# EasyEDA Pro project Pajero Gauges.epro, schematic Schematic2

## Sheets
1 ESP32 + Headers: Board Name: Updated_PCB; Create Date: 2026-03-27; Page Name: ESP32 + Headers; Project Name: Pajero Gauges Current V2; Schematic Name: Schematic2; Update Date: 2026-03-29; Company: EasyEDA.com; Page Size: A4; Version: V1.0
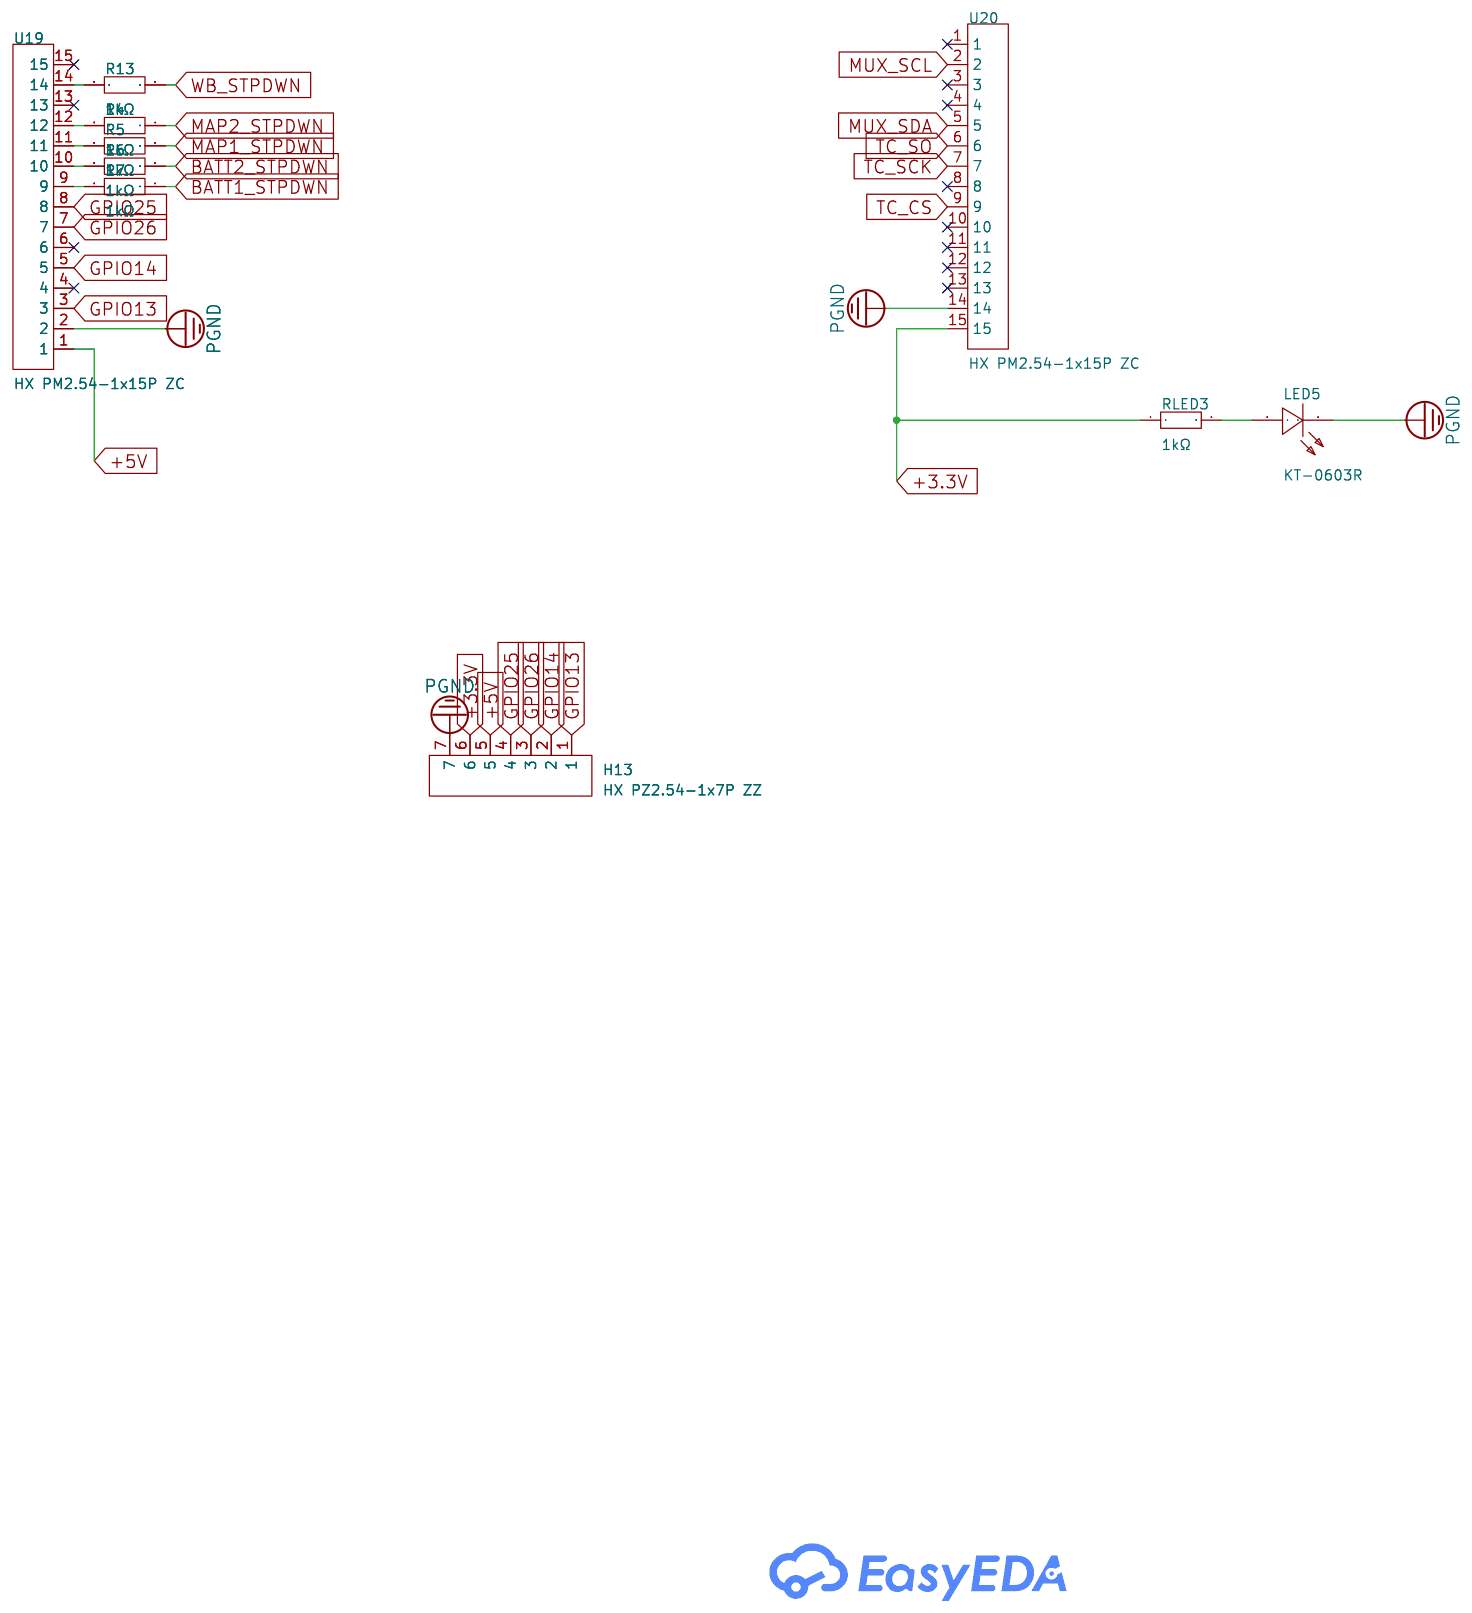
[diagram p11: ESP32 + Headers]
2 12V Input: Page Name: 12V Input; Update Date: 2026-03-27
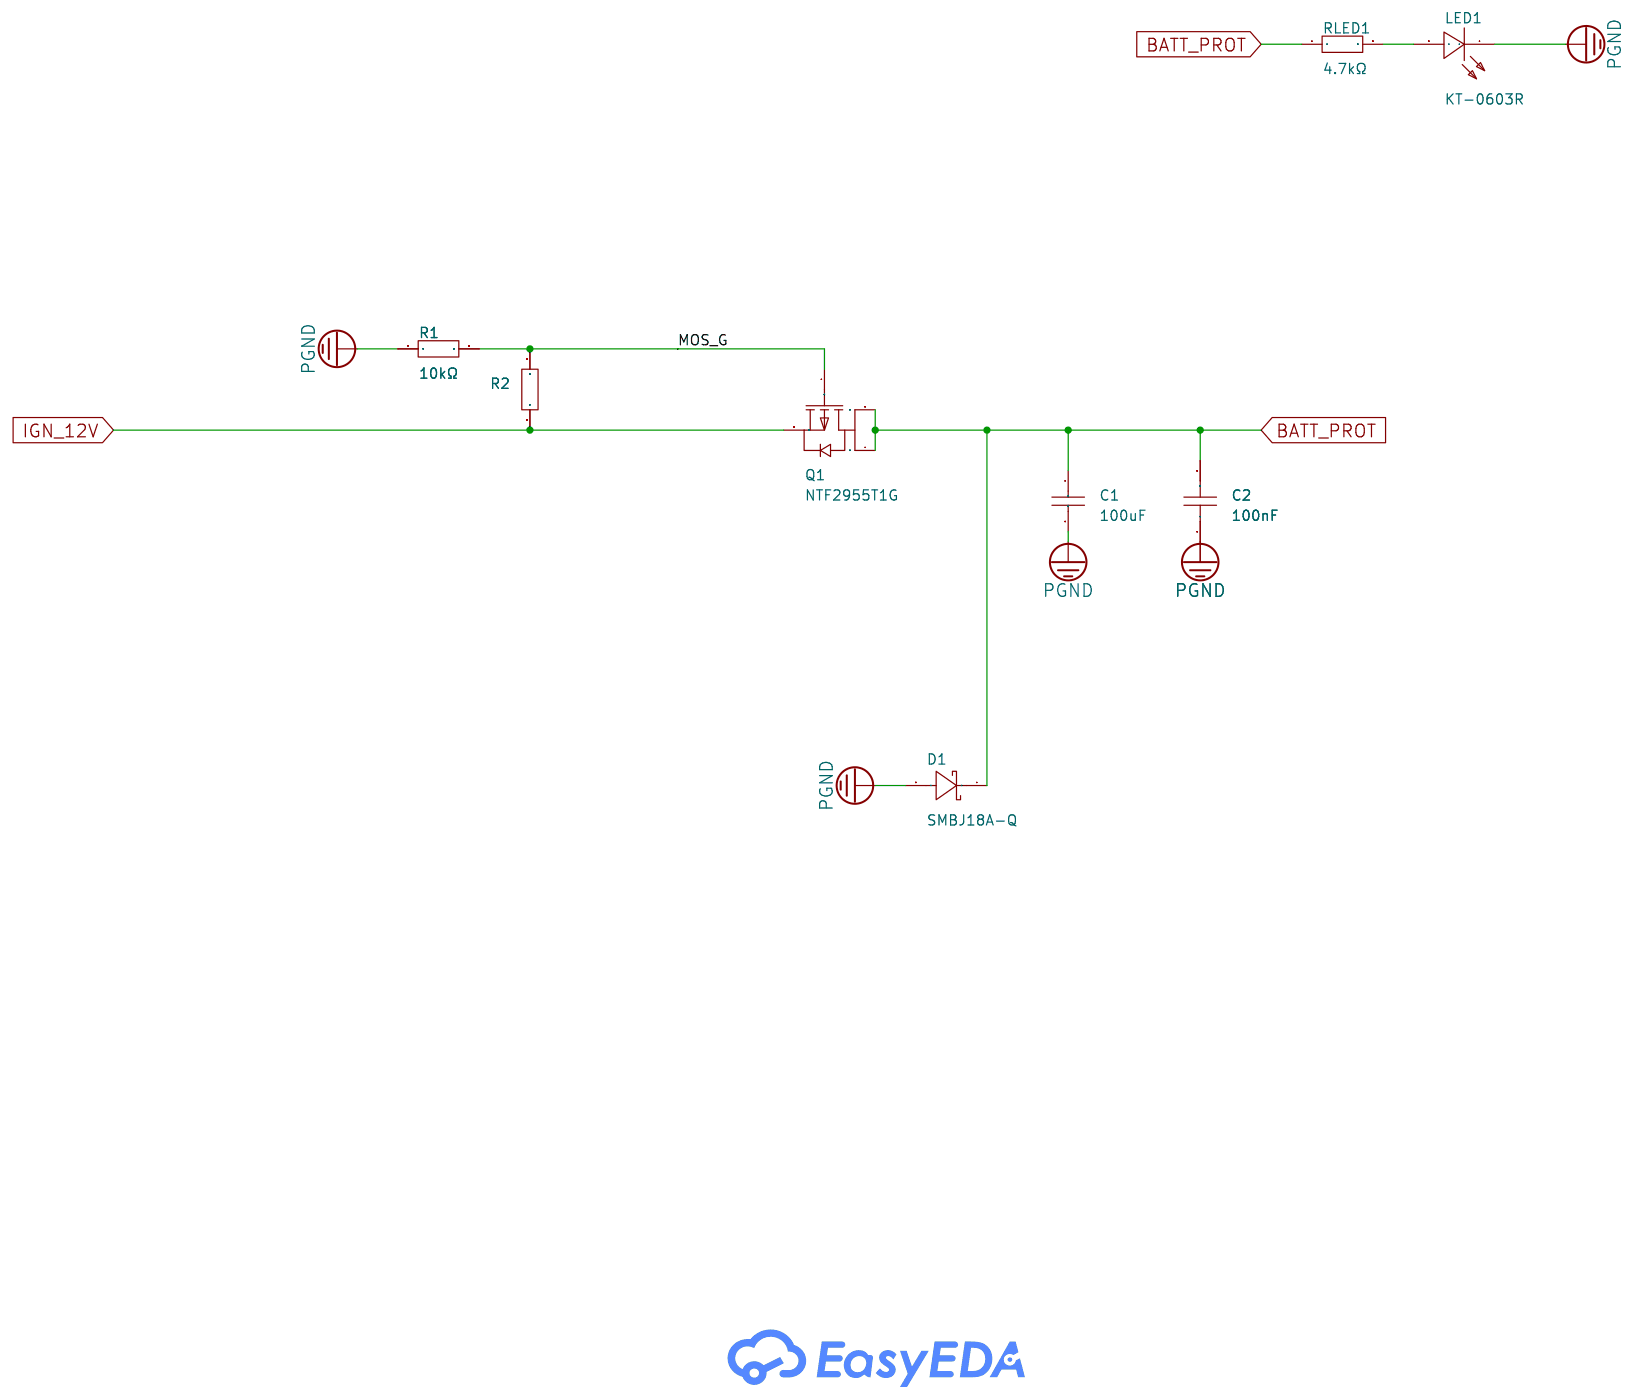
[diagram p12: 12V Input]
3 5V Buck: Page Name: 5V Buck
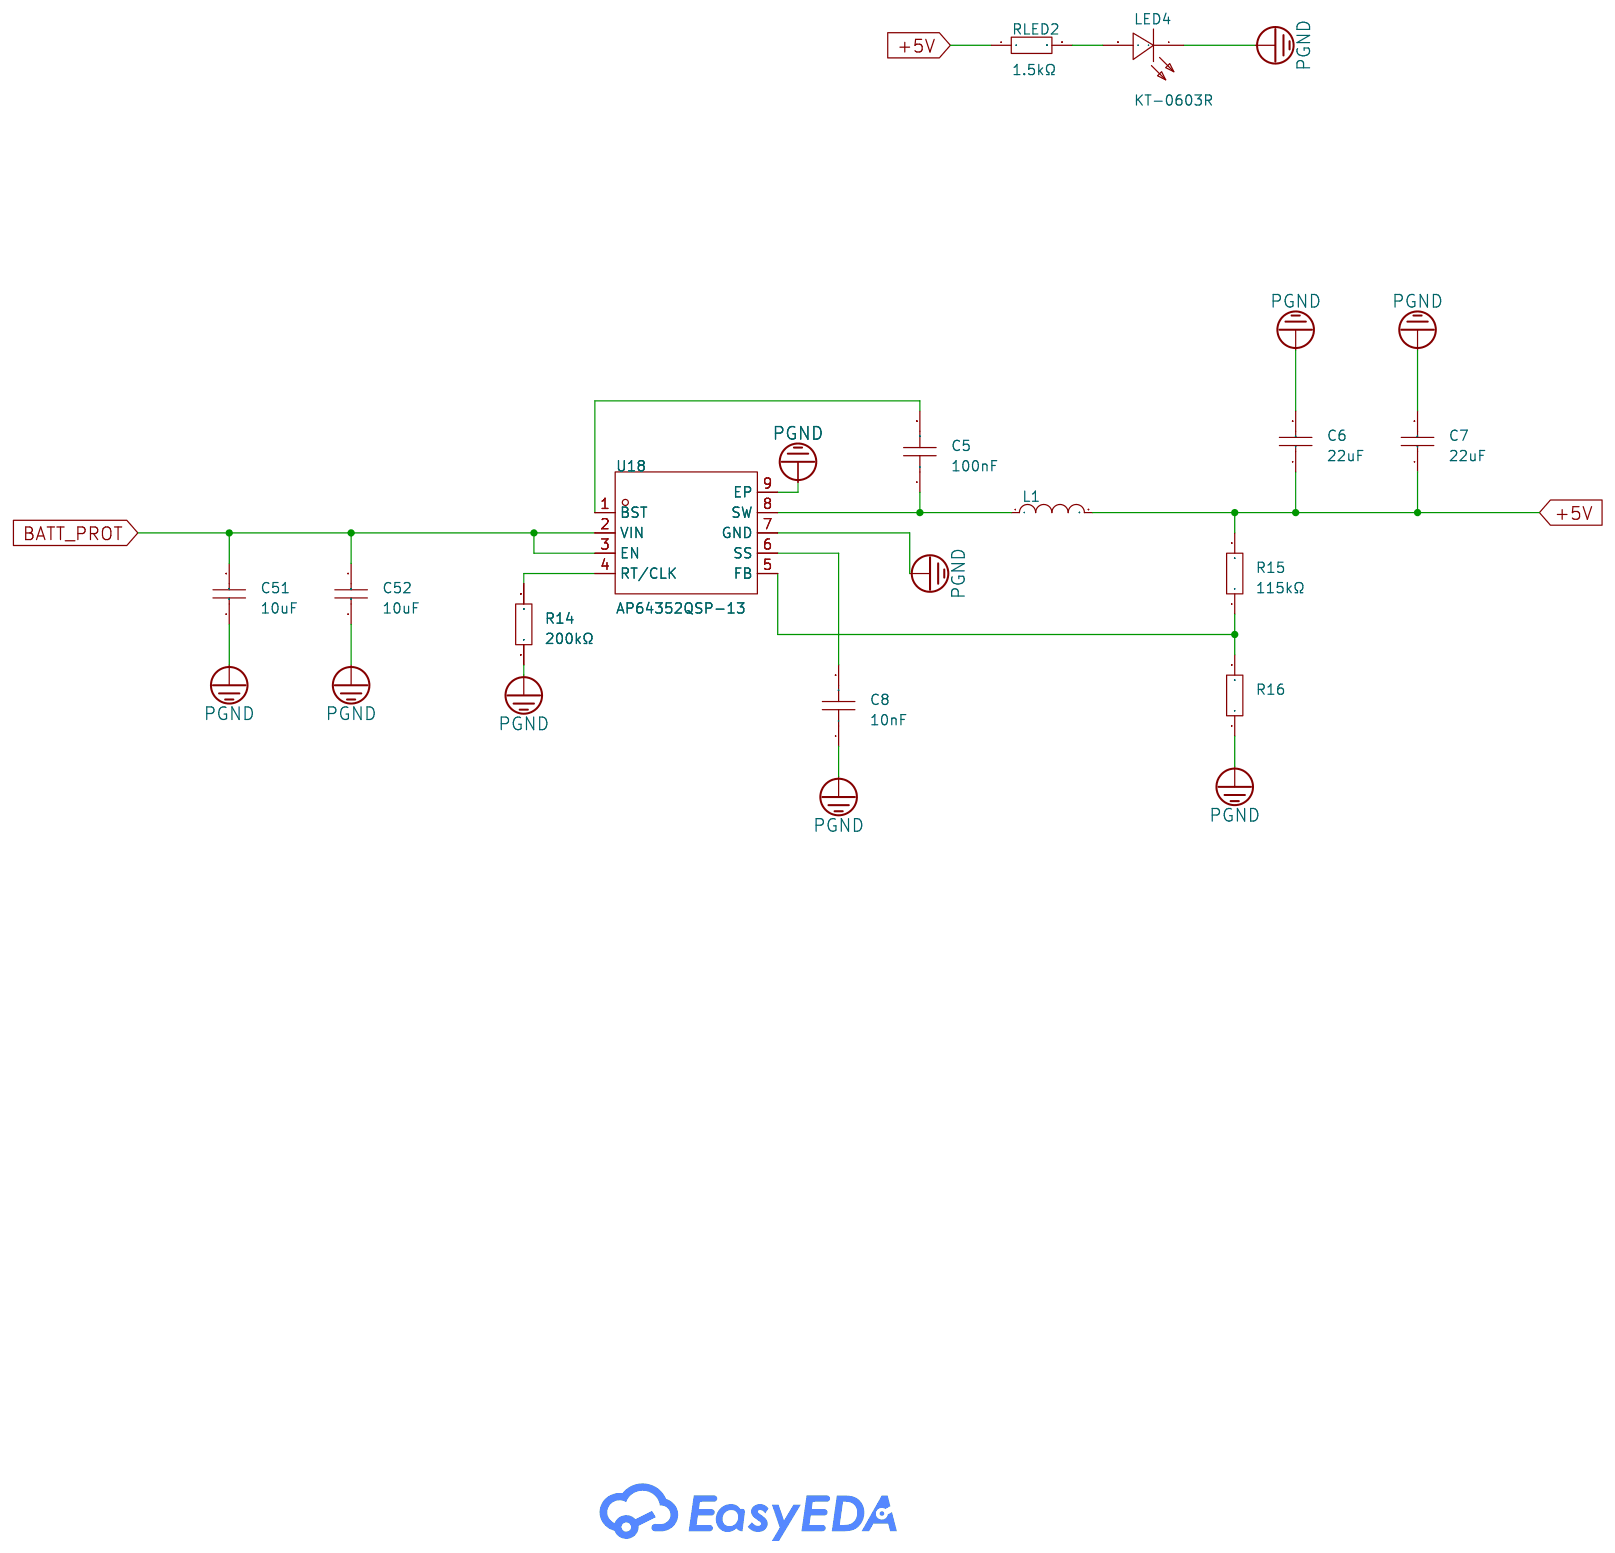
[diagram p13: 5V Buck]
4 Board Connections: Page Name: Board Connections; Update Date: 2026-03-28
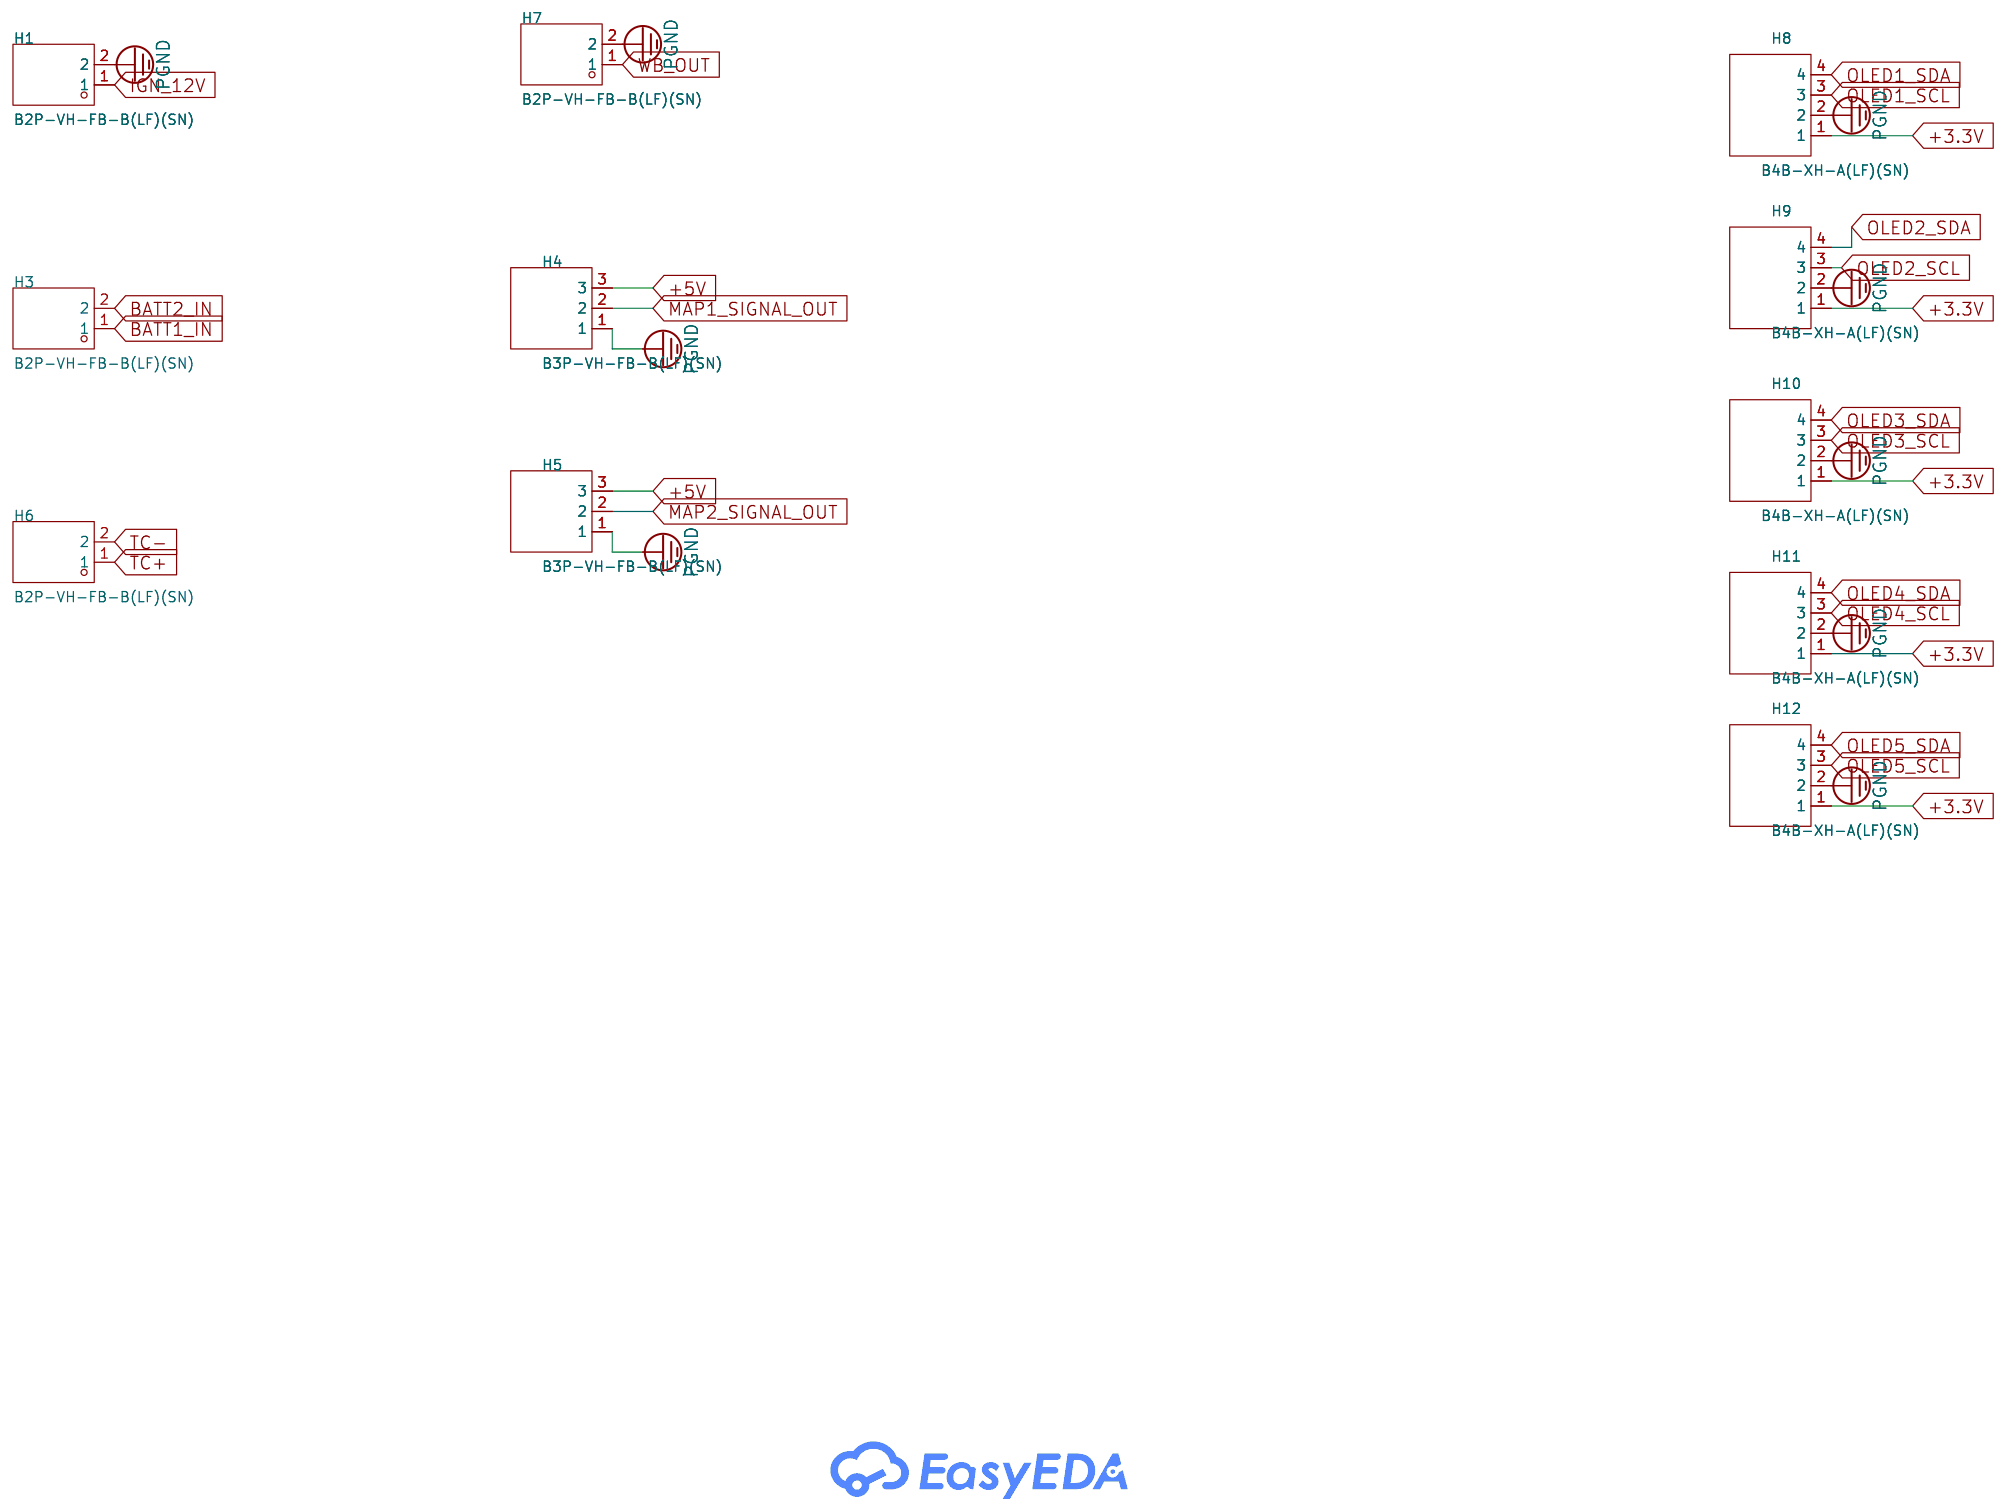
[diagram p14: Board Connections]
5 Voltage Dividers: Page Name: Voltage Dividers; Update Date: 2026-03-27
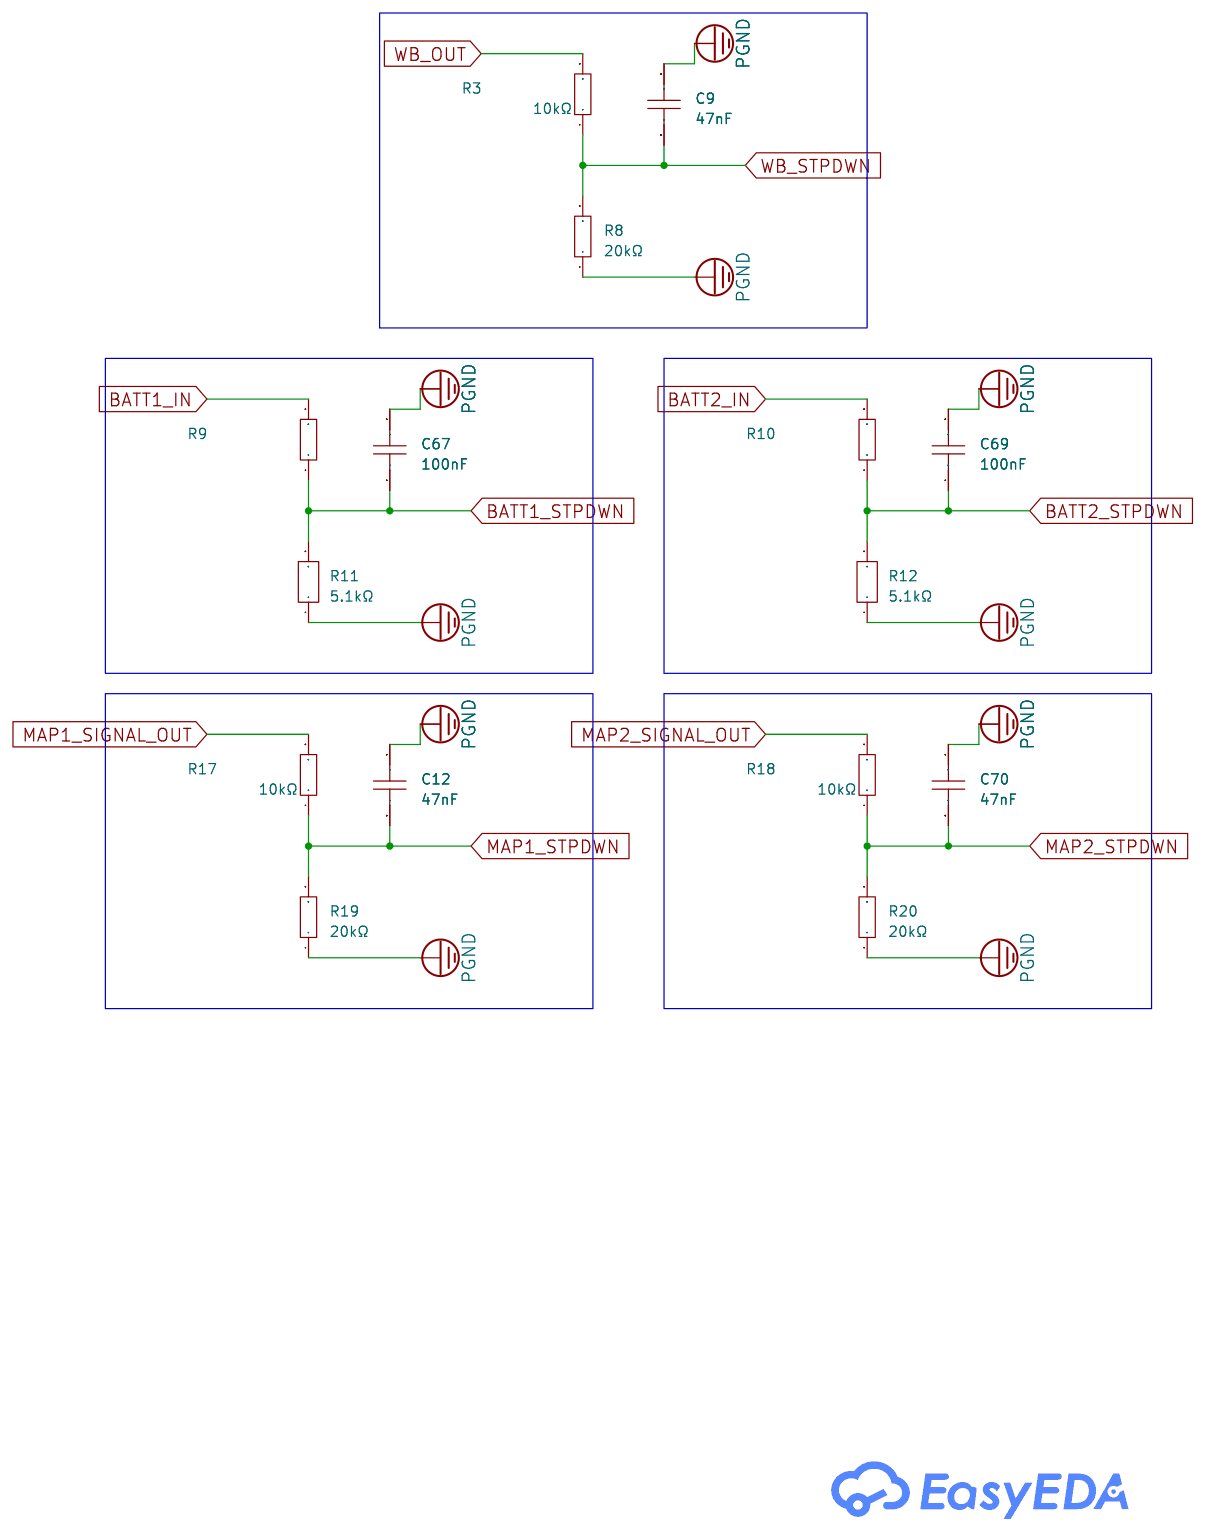
[diagram p15: Voltage Dividers]
6 Thermocouple: Page Name: Thermocouple; Update Date: 2026-03-27
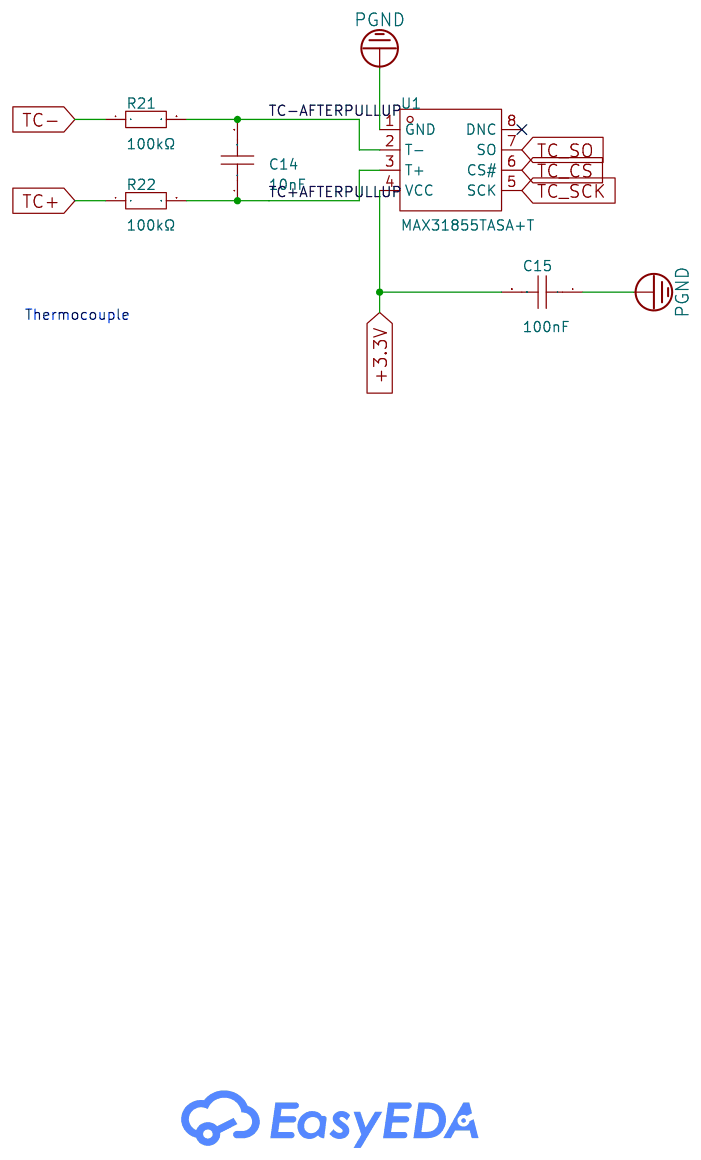
[diagram p16: Thermocouple]
7 Mux: Page Name: Mux; Update Date: 2026-03-27
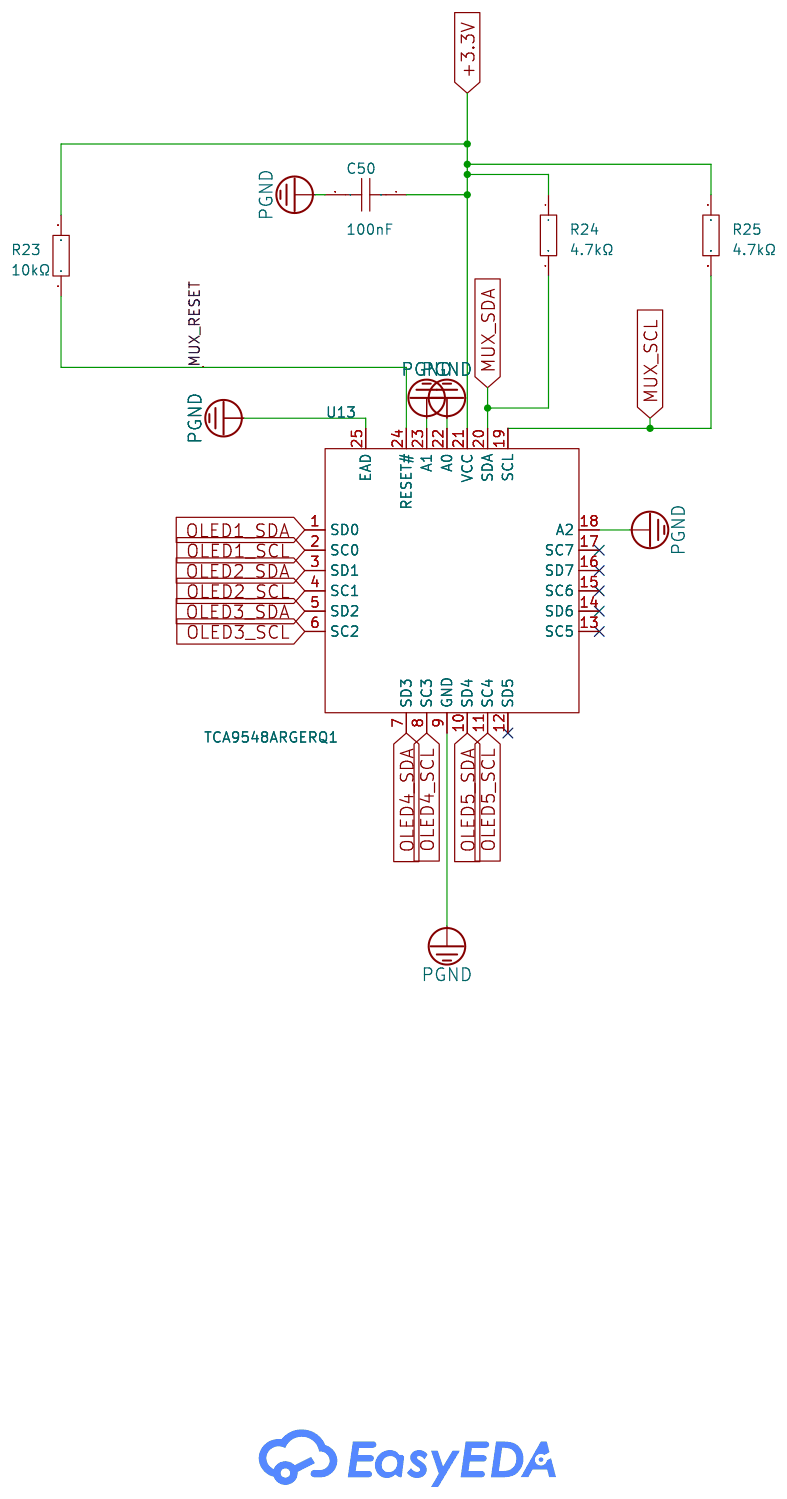
[diagram p17: Mux]

## Parts
sheet 5V Buck
C5  100nF  [C0402]
C6  22uF  [C0805]
C7  22uF  [C0805]
C8  10nF  [C0603]
C51  10uF  [C1206]
C52  10uF  [C1206]
L1  5.6uH  [IND-SMD_L7.0-W6.6_FXL0630]
LED4  KT-0603R  [LED0603-RD]
R14  200kΩ  [R0603]
R15  115kΩ  [R0402]
R16  22.1kΩ  [R0402]
RLED2  1.5kΩ  [R0603]
U18  AP64352QSP-13  [ESOP-8_L4.9-W3.9-P1.27-LS6.0-BL-EP3.1-1]
sheet 12V Input
C1  100uF  [CAP-SMD_BD6.3-L6.6-W6.6-LS7.3-FD-H7.7]
C2  100nF  [C0603]
D1  SMBJ18A-Q  [SMB_L4.3-W3.6-LS5.4-RD]
LED1  KT-0603R  [LED0603-RD]
Q1  NTF2955T1G  [SOT-223-4_L6.5-W3.5-P2.30-LS7.0-BR]
R1  10kΩ  [R0603]
R2  100kΩ  [R0603]
RLED1  4.7kΩ  [R0603]
sheet Board Connections
H1  B2P-VH-FB-B(LF)(SN)  [CONN-TH_2P-P3.96_B2P-VH-FB-B-LF-SN]
H3  B2P-VH-FB-B(LF)(SN)  [CONN-TH_2P-P3.96_B2P-VH-FB-B-LF-SN]
H4  B3P-VH-FB-B(LF)(SN)  [CONN-TH_B3P-VH-FB-B-LF-SN]
H5  B3P-VH-FB-B(LF)(SN)  [CONN-TH_B3P-VH-FB-B-LF-SN]
H6  B2P-VH-FB-B(LF)(SN)  [CONN-TH_2P-P3.96_B2P-VH-FB-B-LF-SN]
H7  B2P-VH-FB-B(LF)(SN)  [CONN-TH_2P-P3.96_B2P-VH-FB-B-LF-SN]
H8  B4B-XH-A(LF)(SN)  [CONN-TH_B4B-XH-A-LF-SN]
H9  B4B-XH-A(LF)(SN)  [CONN-TH_B4B-XH-A-LF-SN]
H10  B4B-XH-A(LF)(SN)  [CONN-TH_B4B-XH-A-LF-SN]
H11  B4B-XH-A(LF)(SN)  [CONN-TH_B4B-XH-A-LF-SN]
H12  B4B-XH-A(LF)(SN)  [CONN-TH_B4B-XH-A-LF-SN]
sheet ESP32 + Headers
H13  HX PZ2.54-1x7P ZZ  [HDR-TH_7P-P2.54-V-M]
LED5  KT-0603R  [LED0603-RD]
R4  1kΩ  [R0603]
R5  1kΩ  [R0603]
R6  1kΩ  [R0603]
R7  1kΩ  [R0603]
R13  1kΩ  [R0603]
RLED3  1kΩ  [R0603]
U19  HX PM2.54-1x15P ZC  [HDR-TH_15P-P2.54-V-F-1]
U20  HX PM2.54-1x15P ZC  [HDR-TH_15P-P2.54-V-F-1]
sheet Mux
C50  100nF  [C0603]
R23  10kΩ  [R0603]
R24  4.7kΩ  [R0603]
R25  4.7kΩ  [R0603]
U13  TCA9548ARGERQ1  [VQFN-24_L4.0-W4.0-P0.50-TL-EP2.8]
sheet Thermocouple
C14  10nF  [C0603]
C15  100nF  [C0603]
R21  100kΩ  [R0603]
R22  100kΩ  [R0603]
U1  MAX31855TASA+T  [SOIC-8_L4.9-W3.9-P1.27-LS6.2-BL]
sheet Voltage Dividers
C9  47nF  [C0603]
C12  47nF  [C0603]
C67  100nF  [C0402]
C69  100nF  [C0402]
C70  47nF  [C0603]
R3  10kΩ  [R0603]
R8  20kΩ  [R0603]
R9  27kΩ  [R0603]
R10  27kΩ  [R0603]
R11  5.1kΩ  [R0603]
R12  5.1kΩ  [R0603]
R17  10kΩ  [R0603]
R18  10kΩ  [R0603]
R19  20kΩ  [R0603]
R20  20kΩ  [R0603]

## Library data of the parts
C5 = CL05B104KB54PNC: Capacitance:100nF Tolerance:±10% Tolerance:±10% Voltage Rating:50V Temperature Coefficient:X7R; LCSC Part Name: 100nF ±10% 50V; Supplier Part: C307331; Manufacturer: SAMSUNG(三星); Supplier Footprint: 0402; JLCPCB Part Class: Basic Part; Datasheet: https://item.szlcsc.com/datasheet/CL05B104KB54PNC/291005.html; Supplier: LCSC; Tolerance: ±10%; Voltage Rating: 50V; Temperature Coefficient: X7R; Check: true
C6 C7 = CL21A226MAQNNNE: Capacitance:22uF Tolerance:±20% Tolerance:±20% Voltage Rating:25V Temperature Coefficient:X5R; LCSC Part Name: 22uF ±20% 25V; Supplier Part: C45783; Manufacturer: SAMSUNG(三星); Supplier Footprint: 0805; JLCPCB Part Class: Basic Part; Datasheet: https://item.szlcsc.com/datasheet/CL21A226MAQNNNE/46786.html; Supplier: LCSC; Tolerance: ±20%; Voltage Rating: 25V; Temperature Coefficient: X5R
C8 C14 = 0603B103K500NT: Capacitance:10nF Tolerance:±10% Tolerance:±10% Voltage Rating:50V Temperature Coefficient:X7R; LCSC Part Name: 10nF ±10% 50V; Supplier Part: C57112; Manufacturer: FH(风华); Supplier Footprint: 0603; JLCPCB Part Class: Basic Part; Datasheet: https://item.szlcsc.com/datasheet/0603B103K500NT/58143.html; Supplier: LCSC; Tolerance: ±10%; Voltage Rating: 50V; Temperature Coefficient: X7R
C51 C52 = CL31A106KBHNNNE: Capacitance:10uF Tolerance:±10% Tolerance:±10% Voltage Rating:50V Temperature Coefficient:X5R; LCSC Part Name: 10uF ±10% 50V; Supplier Part: C13585; Manufacturer: SAMSUNG(三星); Supplier Footprint: 1206; JLCPCB Part Class: Basic Part; Datasheet: https://item.szlcsc.com/datasheet/CL31A106KBHNNNE/14236.html; Supplier: LCSC; Tolerance: ±10%; Voltage Rating: 50V; Temperature Coefficient: X5R; Check: true
L1 = FXL0630-5R6-M: Inductance:5.6uH Tolerance:±20% Tolerance:±20% Current Rating:5.5A Current - Saturation(Isat):6.5A DC Resistance(DCR):42mΩ Type:Molded Inductor; LCSC Part Name: 5.6uH ±20% 6.5A; Supplier Part: C475914; Manufacturer: cjiang(长江微电); Supplier Footprint: SMD,7x6.6mm; JLCPCB Part Class: Extended Part; Datasheet: https://item.szlcsc.com/datasheet/FXL0630-5R6-M/482447.html; Supplier: LCSC; Tolerance: ±20%; Current Rating: 5.5A; Current - Saturation(Isat): 6.5A; DC Resistance(DCR): 42mΩ; Type: Molded Inductor; Current - Saturation (Isat): 12A
LED1 LED4 LED5 = KT-0603R: Lamp Holder Type:- Illumination Color:Red Voltage - Forward(Vf):1.8V~2.4V Voltage - Forward(Vf):1.8V~2.4V Power(Watts):40mW Forward Current:20mA Wavelength - Dominant:615nm~630nm Wavelength - Dominant:615nm~630nm Peak Wavelength:645nm Diode Configuration:; LCSC Part Name: 0603 红灯 高亮; Supplier Part: C2286; Manufacturer: KENTO; Supplier Footprint: 0603; JLCPCB Part Class: Basic Part; Datasheet: https://item.szlcsc.com/datasheet/KT-0603R/2659.html; Supplier: LCSC; Illumination Color: Red; Voltage - Forward(Vf): 1.8V~2.4V; Power(Watts): 40mW; Forward Current: 20mA; Wavelength - Dominant: 615nm~630nm; Peak Wavelength: 645nm; Diode Configuration: Discrete Diode; Lens Color: Water Clear; Luminous Intensity: 300mcd; Viewing Angle: 120°; Operating Temperature: -40℃~+85℃
R14 = 0603WAF2003T5E: Type:Thick Film Resistors Resistance:200kΩ Tolerance:±1% Tolerance:±1% Power(Watts): Overload Voltage (Max): Temperature Coefficient:±100ppm/℃ Temperature Coefficient:±100ppm/℃ Operating Temperature Range:-55℃~+155℃ Operating Temperature Range:-55℃~+155℃; LCSC Part Name: 200kΩ ±1% 100mW 厚膜电阻; Supplier Part: C25811; Manufacturer: UNI-ROYAL(厚声); Supplier Footprint: 0603; JLCPCB Part Class: Basic Part; Datasheet: https://atta.szlcsc.com/upload/public/pdf/source/20200306/C422600_1E6D84923E4A46A82E41ADD87F860B5C.pdf; Supplier: LCSC; Type: Thick Film Resistors; Tolerance: ±1%; Temperature Coefficient: ±100ppm/℃; Operating Temperature Range: -55℃~+155℃
R15 = RC0402FR-07115KL: Type:Thick Film Resistors Resistance: Tolerance:±1% Tolerance:±1% Power(Watts): Overload Voltage (Max): Temperature Coefficient:±100ppm/℃ Temperature Coefficient:±100ppm/℃ Operating Temperature Range:-55℃~+155℃ Operating Temperature Range:-55℃~+155℃; LCSC Part Name: 厚膜电阻 115kΩ ±1% 62.5mW; Supplier Part: C273341; Manufacturer: YAGEO(国巨); Supplier Footprint: 0402; JLCPCB Part Class: Extended Part; Datasheet: https://atta.szlcsc.com/upload/public/pdf/source/20180821/C275644_0D56F95EFF785E7D9A1FEF436B37DA78.pdf; Supplier: LCSC; Type: Thick Film Resistors; Tolerance: ±1%; Temperature Coefficient: ±100ppm/℃; Operating Temperature Range: -55℃~+155℃
R16 = RMC040222.1K1%N: Type:Thick Film Resistor Resistance:22.1kΩ Tolerance:±1% Tolerance:±1% Power(Watts):62.5mW Voltage-Supply(Max):50V Temperature Coefficient:±100ppm/℃ Temperature Coefficient:±100ppm/℃ Operating Temperature:-55℃~+155℃ Operating Temperature:-55℃~+155℃; LCSC Part Name: 22.1kΩ ±1% 62.5mW; Supplier Part: C325588; Manufacturer: Tyohm(幸亚电阻); Supplier Footprint: 0402; JLCPCB Part Class: Extended Part; Datasheet: https://item.szlcsc.com/datasheet/RMC040222.1K1%2525N/305793.html; Supplier: LCSC; Type: Thick Film Resistor; Tolerance: ±1%; Power(Watts): 62.5mW; Voltage-Supply(Max): 50V; Temperature Coefficient: ±100ppm/℃; Operating Temperature: -55℃~+155℃
RLED2 = 0603WAF2701T5E: Type:Thick Film Resistor Resistance:2.7kΩ Tolerance:±1% Tolerance:±1% Power(Watts):100mW Voltage-Supply(Max):75V Temperature Coefficient:±100ppm/℃ Temperature Coefficient:±100ppm/℃ Operating Temperature:-55℃~+155℃ Operating Temperature:-55℃~+155℃; LCSC Part Name: 2.7kΩ ±1% 100mW 厚膜电阻; Supplier Part: C13167; Manufacturer: UNI-ROYAL(厚声); Supplier Footprint: 0603; JLCPCB Part Class: Basic Part; Datasheet: https://item.szlcsc.com/datasheet/0603WAF2701T5E/13814.html; Supplier: LCSC; Type: Thick Film Resistor; Tolerance: ±1%; Power(Watts): 100mW; Voltage-Supply(Max): 75V; Temperature Coefficient: ±100ppm/℃; Operating Temperature: -55℃~+155℃
U18 = AP64352QSP-13: Function:Step-down type Output Type:- Input Voltage:3.8V~40V Input Voltage:3.8V~40V Output Voltage:- Output Voltage:- Output Current:3.5A Switching Frequency:100kHz~2.2MHz Switching Frequency:100kHz~2.2MHz Operating Temperature:-40℃~+125℃ Operating Temper; LCSC Part Name: 汽车级3.5A同步降压转换器; Supplier Part: C5248547; Manufacturer: DIODES(美台); Supplier Footprint: SO-8-EP; JLCPCB Part Class: Extended Part; Datasheet: https://atta.szlcsc.com/upload/public/pdf/source/20230810/2AEDEB1FA173BEEBC584456D0418AFCB.pdf; Supplier: LCSC; Function: Step-down type; Input Voltage: 3.8V~40V; Output Current: 3.5A; Switching Frequency: 100kHz~2.2MHz; Operating Temperature: -40℃~+125℃; Number of Outputs: 1; Topology: Step-down; Quiescent Current (Iq): 22uA; Switch tube (built-in/external): Built-in
C1 = RVT50V100M6X8: Capacitance:100uF Tolerance:±20% Tolerance:±20% Voltage Rating:50V Ripple Current:146mA@120Hz Diameter:6.3mm Height - Seated (Max):7.7mm Lifetime:2000hrs@105℃ Operating Temperature:-55℃~+105℃ Operating Temperature:-55℃~+105℃; LCSC Part Name: 100uF ±20% 50V; Supplier Part: C47023117; Manufacturer: JIERR(捷而瑞); Supplier Footprint: SMD,D6.3xL7.7mm; JLCPCB Part Class: Extended Part; Datasheet: https://item.szlcsc.com/datasheet/RVT50V100M6X8/49206218.html; Supplier: LCSC; Tolerance: ±20%; Voltage Rating: 50V; Ripple Current: 146mA@120Hz; Diameter: 6.3mm; Height - Seated (Max): 7.7mm; Lifetime: 2000hrs@105℃; Operating Temperature: -55℃~+105℃; Temperature Coefficient: X5R
C2 C15 C50 = CC0603KRX7R9BB104: Capacitance:100nF Tolerance:±10% Tolerance:±10% Voltage Rating:50V Temperature Coefficient:X7R; LCSC Part Name: 100nF ±10% 50V; Supplier Part: C14663; Manufacturer: YAGEO(国巨); Supplier Footprint: 0603; JLCPCB Part Class: Basic Part; Datasheet: https://item.szlcsc.com/datasheet/CC0603KRX7R9BB104/15331.html; Supplier: LCSC; Tolerance: ±10%; Voltage Rating: 50V; Temperature Coefficient: X7R
D1 = SMBJ18A-Q: Reverse Stand-Off Voltage (Vrwm):18V Clamping Voltage:38V Peak Pulse Current (Ipp):103A@8/20us Peak Pulse Power Dissipation (Ppp):600W@1ms Voltage - Breakdown:24.5V Reverse Leakage Current (Ir):1uA Operating Temperature:-55℃~+150℃ Operating Temperature:-5; Supplier Part: C1979859; Manufacturer: BOURNS; Supplier Footprint: SMB(DO-214AA); JLCPCB Part Class: Extended Part; Datasheet: https://item.szlcsc.com/datasheet/SMBJ18A-Q/2071397.html; Supplier: LCSC; Reverse Stand-Off Voltage (Vrwm): 18V; Clamping Voltage: 38V; Peak Pulse Current (Ipp): 103A@8/20us; Peak Pulse Power Dissipation (Ppp): 600W@1ms; Voltage - Breakdown: 24.5V; Reverse Leakage Current (Ir): 1uA; Operating Temperature: -55℃~+150℃; Type: TVS
Q1 = NTF2955T1G: Number:1 P-Channel Drain to Source Voltage:60V Current - Continuous Drain(Id):2.6A RDS(on):185mΩ@10V,2.4A Pd - Power Dissipation:2.3W Gate Threshold Voltage (Vgs(th)):4V@1.0mA Gate Charge(Qg):14.3nC@10V Input Capacitance(Ciss):492pF Reverse Transfer Capac; LCSC Part Name: 1个P沟道 耐压:60V 电流:2.6A; Supplier Part: C17265; Manufacturer: onsemi(安森美); Supplier Footprint: SOT-223; JLCPCB Part Class: Extended Part; Datasheet: https://item.szlcsc.com/datasheet/NTF2955T1G/17950.html; Supplier: LCSC; Number: 1 P-Channel; Drain to Source Voltage: 60V; Current - Continuous Drain(Id): 2.6A; RDS(on): 185mΩ@10V,2.4A; Pd - Power Dissipation: 2.3W; Gate Threshold Voltage (Vgs(th)): 4V@1.0mA; Gate Charge(Qg): 14.3nC@10V; Input Capacitance(Ciss): 492pF; Reverse Transfer Capacitance (Crss@Vds): 50pF; Operating Temperature: -55℃~+175℃; Type: P-Channel; Output Capacitance(Coss): 165pF
R1 R3 = 0603WAF1002T5E: Type:Thick Film Resistor Resistance:10kΩ Tolerance:±1% Tolerance:±1% Power(Watts):100mW Voltage-Supply(Max):75V Temperature Coefficient:±100ppm/℃ Temperature Coefficient:±100ppm/℃ Operating Temperature:-55℃~+155℃ Operating Temperature:-55℃~+155℃; LCSC Part Name: 厚膜电阻 10kΩ ±1% 100mW; Supplier Part: C25804; Manufacturer: UNI-ROYAL(厚声); Supplier Footprint: 0603; JLCPCB Part Class: Basic Part; Datasheet: https://item.szlcsc.com/datasheet/0603WAF1002T5E/26547.html; Supplier: LCSC; Type: Thick Film Resistor; Tolerance: ±1%; Power(Watts): 100mW; Voltage-Supply(Max): 75V; Temperature Coefficient: ±100ppm/℃; Operating Temperature: -55℃~+155℃; Operating Temperature Range: -55℃~+155℃
R2 R21 R22 = 0603WAF1003T5E: Type:Thick Film Resistor Resistance:100kΩ Tolerance:±1% Tolerance:±1% Power(Watts):100mW Voltage-Supply(Max):75V Temperature Coefficient:±100ppm/℃ Temperature Coefficient:±100ppm/℃ Operating Temperature:-55℃~+155℃ Operating Temperature:-55℃~+155℃; LCSC Part Name: 100kΩ ±1% 100mW 厚膜电阻; Supplier Part: C25803; Manufacturer: UNI-ROYAL(厚声); Supplier Footprint: 0603; JLCPCB Part Class: Basic Part; Datasheet: https://item.szlcsc.com/datasheet/0603WAF1003T5E/26546.html; Supplier: LCSC; Type: Thick Film Resistor; Tolerance: ±1%; Power(Watts): 100mW; Voltage-Supply(Max): 75V; Temperature Coefficient: ±100ppm/℃; Operating Temperature: -55℃~+155℃
R24 R25 RLED1 = 0603WAF4701T5E: Type:Thick Film Resistor Resistance:4.7kΩ Tolerance:±1% Tolerance:±1% Power(Watts):100mW Voltage-Supply(Max):75V Temperature Coefficient:±100ppm/℃ Temperature Coefficient:±100ppm/℃ Operating Temperature:-55℃~+155℃ Operating Temperature:-55℃~+155℃; LCSC Part Name: 4.7kΩ ±1% 100mW 厚膜电阻; Supplier Part: C23162; Manufacturer: UNI-ROYAL(厚声); Supplier Footprint: 0603; JLCPCB Part Class: Basic Part; Datasheet: https://item.szlcsc.com/datasheet/0603WAF4701T5E/23889.html; Supplier: LCSC; Type: Thick Film Resistor; Tolerance: ±1%; Power(Watts): 100mW; Voltage-Supply(Max): 75V; Temperature Coefficient: ±100ppm/℃; Operating Temperature: -55℃~+155℃
H1 H3 H6 H7 = B2P-VH-FB-B(LF)(SN): Pins Structure:1x2P Pitch:3.96mm Mounting Type:Through Hole Reference Series:VH Number of Pins:2P Number of Rows:1 Number of PINs Per Row:2 Row Spacing:- Current Rating:10A Contact Material:Copper Alloy Contact Plating:Tin Operating Temperature:-25℃~+85℃; LCSC Part Name: 1x2P 间距:3.96mm 直插 系列:VH; Supplier Part: C158006; Manufacturer: JST; Supplier Footprint: 插件,P=3.96mm; JLCPCB Part Class: Extended Part; Datasheet: https://item.szlcsc.com/datasheet/B2P-VH-FB-B(LF)(SN)/169354.html; Supplier: LCSC; Pins Structure: 1x2P; Pitch: 3.96mm; Mounting Type: Through Hole; Reference Series: VH; Number of Pins: 2P; Number of Rows: 1; Number of PINs Per Row: 2; Current Rating: 10A; Contact Material: Copper Alloy; Contact Plating: Tin; Operating Temperature: -25℃~+85℃; Voltage Rating: 250V; Plastic Material: Glass-Fiber Reinforced PBT; Flame Retardant Rating: UL94V-0; Supplementary Features: Pillar; Color: White; Z-Height of the Board: 11mm; X-Length of Bottom Edge on Board (Spacing Line): 9.8mm; Y-Width of Bottom Edge on Board: 9.7mm
H4 H5 = B3P-VH-FB-B(LF)(SN): Pins Structure:1x3P Pitch:3.96mm Mounting Type:Through Hole Reference Series:VH Number of Pins:3P Number of Rows:1 Number of PINs Per Row:3 Row Spacing:- Current Rating:10A Contact Material:Copper Alloy Contact Plating:Tin Operating Temperature:-25℃~+85℃; LCSC Part Name: 1x3P 间距:3.96mm 直插 系列:VH; Supplier Part: C158000; Manufacturer: JST; Supplier Footprint: 插件,P=3.96mm; JLCPCB Part Class: Extended Part; Datasheet: https://item.szlcsc.com/datasheet/B3P-VH-FB-B(LF)(SN)/169348.html; Supplier: LCSC; Pins Structure: 1x3P; Pitch: 3.96mm; Mounting Type: Through Hole; Reference Series: VH; Number of Pins: 3P; Number of Rows: 1; Number of PINs Per Row: 3; Current Rating: 10A; Contact Material: Copper Alloy; Contact Plating: Tin; Operating Temperature: -25℃~+85℃; Voltage Rating: 250V; Plastic Material: Glass-Fiber Reinforced PBT; Flame Retardant Rating: UL94V-0; Supplementary Features: Pillar; Color: White; Z-Height of the Board: 11mm; X-Length of Bottom Edge on Board (Spacing Line): 13.76mm; Y-Width of Bottom Edge on Board: 9.7mm
H8-H12 = B4B-XH-A(LF)(SN): Pins Structure:1x4P Pitch:2.5mm Mounting Type:Through Hole Reference Series:XH Number of Pins:4P Number of Rows:1 Number of PINs Per Row:4 Row Spacing:- Current Rating:3A Contact Material:Brass Contact Plating:Tin Operating Temperature:-25℃~+85℃ Operating; LCSC Part Name: 1x4P 间距:2.5mm 直插 系列:XH; Supplier Part: C144395; Manufacturer: JST; Supplier Footprint: 插件,P=2.5mm; JLCPCB Part Class: Extended Part; Datasheet: https://item.szlcsc.com/datasheet/B4B-XH-A(LF)(SN)/155727.html; Supplier: LCSC; Pins Structure: 1x4P; Pitch: 2.5mm; Mounting Type: Through Hole; Reference Series: XH; Number of Pins: 4P; Number of Rows: 1; Number of PINs Per Row: 4; Current Rating: 3A; Contact Material: Brass; Contact Plating: Tin; Operating Temperature: -25℃~+85℃; Voltage Rating: 250V; Plastic Material: PA66; Flame Retardant Rating: UL94V-0; Supplementary Features: K Pin; Color: White; Z-Height of the Board: 7mm; X-Length of Bottom Edge on Board (Spacing Line): 12.4mm; Y-Width of Bottom Edge on Board: 5.75mm
H13 = HX PZ2.54-1x7P ZZ: Pin Structure:1x7P Pitch:2.54mm Row Spacing:- Circluar Pins/Square Pins:Pin Header Mounting Type:Through Hole Number of Rows:1 Number of Pins:7P Current Rating:3A Voltage Rating (Max):1kV Length of Mating Pin:6mm Insulation Height:2.5mm Length of End Conn; LCSC Part Name: 1x7P 间距:2.54mm 方针 直插; Supplier Part: C32713273; Manufacturer: hanxia(韩下); Supplier Footprint: 插件,P=2.54mm; JLCPCB Part Class: Extended Part; Datasheet: https://item.szlcsc.com/datasheet/HX%2520PZ2.54-1x7P%2520ZZ/34444553.html; Supplier: LCSC; Pin Structure: 1x7P; Pitch: 2.54mm; Circluar Pins/Square Pins: Pin Header; Mounting Type: Through Hole; Number of Rows: 1; Number of Pins: 7P; Current Rating: 3A; Voltage Rating (Max): 1kV; Length of Mating Pin: 6mm; Insulation Height: 2.5mm; Length of End Connection Pin: 3mm; Contact Material: Brass; Contact Plating: Gold; Operating Temperature: -40℃~+105℃; Color: Black
R4-R7 R13 RLED3 = 0603WAF1001T5E: Type:Thick Film Resistor Resistance:1kΩ Tolerance:±1% Tolerance:±1% Power(Watts):100mW Voltage-Supply(Max):75V Temperature Coefficient:±100ppm/℃ Temperature Coefficient:±100ppm/℃ Operating Temperature:-55℃~+155℃ Operating Temperature:-55℃~+155℃; LCSC Part Name: 1kΩ ±1% 100mW 厚膜电阻; Supplier Part: C21190; Manufacturer: UNI-ROYAL(厚声); Supplier Footprint: 0603; JLCPCB Part Class: Basic Part; Datasheet: https://item.szlcsc.com/datasheet/0603WAF1001T5E/21904.html; Supplier: LCSC; Type: Thick Film Resistor; Tolerance: ±1%; Power(Watts): 100mW; Voltage-Supply(Max): 75V; Temperature Coefficient: ±100ppm/℃; Operating Temperature: -55℃~+155℃
U19 U20 = HX PM2.54-1x15P ZC: Holes Structure:1x15P Pitch:2.54mm Row Spacing:- Circular Hole / Square Hole:Square Hole Mounting Type:Through Hole Number of Rows:1 Number of Positions:15P Current Rating:3A Voltage Rating (Max):1kV Holes Direction:Top Insulation Height:8.5mm Contact Mat; LCSC Part Name: 1x15P 间距:2.54mm 直插; Supplier Part: C41417327; Manufacturer: hanxia(韩下); Supplier Footprint: 插件,P=2.54mm; JLCPCB Part Class: Extended Part; Datasheet: https://item.szlcsc.com/datasheet/HX%2520PM2.54-1x15P%2520ZC/43243331.html; Supplier: LCSC; Holes Structure: 1x15P; Pitch: 2.54mm; Circular Hole / Square Hole: Square Hole; Mounting Type: Through Hole; Number of Rows: 1; Number of Positions: 15P; Current Rating: 3A; Voltage Rating (Max): 1kV; Holes Direction: Top; Insulation Height: 8.5mm; Contact Material: Brass; Contact Plating: Gold; Operating Temperature: -40℃~+105℃; PIN Length: 3.2mm
R17 R18 R23 = 0603WAF1002T5E: Type:Thick Film Resistor Resistance:10kΩ Tolerance:±1% Tolerance:±1% Power(Watts):100mW Voltage-Supply(Max):75V Temperature Coefficient:±100ppm/℃ Temperature Coefficient:±100ppm/℃ Operating Temperature:-55℃~+155℃ Operating Temperature:-55℃~+155℃; LCSC Part Name: 厚膜电阻 10kΩ ±1% 100mW; Supplier Part: C25804; Manufacturer: UNI-ROYAL(厚声); Supplier Footprint: 0603; JLCPCB Part Class: Basic Part; Datasheet: https://item.szlcsc.com/datasheet/0603WAF1002T5E/26547.html; Supplier: LCSC; Type: Thick Film Resistor; Tolerance: ±1%; Power(Watts): 100mW; Voltage-Supply(Max): 75V; Temperature Coefficient: ±100ppm/℃; Operating Temperature: -55℃~+155℃
U13 = TCA9548ARGERQ1: LCSC Part Name: 支持复位的汽车8通道I2C开关; Supplier Part: C2674697; Manufacturer: TI(德州仪器); Supplier Footprint: VQFN-24-EP(4x4); JLCPCB Part Class: Extended Part; Datasheet: https://www.ti.com/cn/lit/gpn/tca9548a-q1; Supplier: LCSC; Check: true
U1 = MAX31855TASA+T: Resolution:14 Number of Channels:- Voltage - Supply:3V~3.6V Voltage - Supply:3V~3.6V Interface Type:SPI Chip Type Parameters/Description:Cold Junction Compensation Thermocouple to Digital Converter Operating Temperature:-40℃~+125℃ Operating Temperature:-4; LCSC Part Name: 冷端补偿热电偶转数字转换器; Supplier Part: C476183; Manufacturer: ADI(亚德诺)/MAXIM(美信); Supplier Footprint: SO-8; JLCPCB Part Class: Extended Part; Datasheet: https://item.szlcsc.com/datasheet/MAX31855TASA%252BT/483089.html; Supplier: LCSC; Resolution: 14; Voltage - Supply: 3V~3.6V; Interface Type: SPI; Chip Type Parameters/Description: Cold Junction Compensation Thermocouple to Digital Converter; Operating Temperature: -40℃~+125℃
C9 C12 C70 = CL10B473KB8NNNC: Capacitance:47nF Tolerance:±10% Tolerance:±10% Voltage Rating:50V Temperature Coefficient:X7R; LCSC Part Name: 47nF ±10% 50V; Supplier Part: C1622; Manufacturer: SAMSUNG(三星); Supplier Footprint: 0603; JLCPCB Part Class: Basic Part; Datasheet: https://item.szlcsc.com/datasheet/CL10B473KB8NNNC/1974.html; Supplier: LCSC; Tolerance: ±10%; Voltage Rating: 50V; Temperature Coefficient: X7R
C67 C69 = CL05B104KB54PNC: Capacitance:100nF Tolerance:±10% Tolerance:±10% Voltage Rating:50V Temperature Coefficient:X7R; LCSC Part Name: 100nF ±10% 50V; Supplier Part: C307331; Manufacturer: SAMSUNG(三星); Supplier Footprint: 0402; JLCPCB Part Class: Basic Part; Datasheet: https://item.szlcsc.com/datasheet/CL05B104KB54PNC/291005.html; Supplier: LCSC; Tolerance: ±10%; Voltage Rating: 50V; Temperature Coefficient: X7R
R8 R19 R20 = 0603WAF2002T5E: Type:Thick Film Resistor Resistance:20kΩ Tolerance:±1% Tolerance:±1% Power(Watts):100mW Voltage-Supply(Max):75V Temperature Coefficient:±100ppm/℃ Temperature Coefficient:±100ppm/℃ Operating Temperature:-55℃~+155℃ Operating Temperature:-55℃~+155℃; LCSC Part Name: 20kΩ ±1% 100mW 厚膜电阻; Supplier Part: C4184; Manufacturer: UNI-ROYAL(厚声); Supplier Footprint: 0603; JLCPCB Part Class: Basic Part; Datasheet: https://item.szlcsc.com/datasheet/0603WAF2002T5E/4591.html; Supplier: LCSC; Type: Thick Film Resistor; Tolerance: ±1%; Power(Watts): 100mW; Voltage-Supply(Max): 75V; Temperature Coefficient: ±100ppm/℃; Operating Temperature: -55℃~+155℃
R9 R10 = 0603WAF2702T5E: Type:Thick Film Resistor Resistance:27kΩ Tolerance:±1% Tolerance:±1% Power(Watts):100mW Voltage-Supply(Max):75V Temperature Coefficient:±100ppm/℃ Temperature Coefficient:±100ppm/℃ Operating Temperature:-55℃~+155℃ Operating Temperature:-55℃~+155℃; LCSC Part Name: 27kΩ ±1% 100mW 厚膜电阻; Supplier Part: C22967; Manufacturer: UNI-ROYAL(厚声); Supplier Footprint: 0603; JLCPCB Part Class: Basic Part; Datasheet: https://item.szlcsc.com/datasheet/0603WAF2702T5E/23694.html; Supplier: LCSC; Type: Thick Film Resistor; Tolerance: ±1%; Power(Watts): 100mW; Voltage-Supply(Max): 75V; Temperature Coefficient: ±100ppm/℃; Operating Temperature: -55℃~+155℃
R11 R12 = 0603WAF5101T5E: Type:Thick Film Resistor Resistance:5.1kΩ Tolerance:±1% Tolerance:±1% Power(Watts):100mW Voltage-Supply(Max):75V Temperature Coefficient:±100ppm/℃ Temperature Coefficient:±100ppm/℃ Operating Temperature:-55℃~+155℃ Operating Temperature:-55℃~+155℃; LCSC Part Name: 5.1kΩ ±1% 100mW 厚膜电阻; Supplier Part: C23186; Manufacturer: UNI-ROYAL(厚声); Supplier Footprint: 0603; JLCPCB Part Class: Basic Part; Datasheet: https://item.szlcsc.com/datasheet/0603WAF5101T5E/23913.html; Supplier: LCSC; Type: Thick Film Resistor; Tolerance: ±1%; Power(Watts): 100mW; Voltage-Supply(Max): 75V; Temperature Coefficient: ±100ppm/℃; Operating Temperature: -55℃~+155℃

## Nets
+3.3V: C15.2 C50.1 H8.1 H9.1 H10.1 H11.1 H12.1 H13.6 R23.2 R24.1 R25.1 RLED3.1 U1.4(VCC) U13.21(VCC) U20.15
+5V: C6.1 C7.1 H4.3 H5.3 H13.5 L1.2 R15.2 RLED2.1 U19.1
PGND: C1.2 C2.1 C6.2 C7.2 C8.1 C9.1 C12.1 C15.1 C50.2 C51.1 C52.1 C67.2 C69.2 C70.1 D1.2(A) H1.2 H4.1 H5.1 H7.2 H8.2 H9.2 H10.2 H11.2 H12.2 H13.7 LED1.1(K) LED4.1(K) LED5.1(K) R1.1 R8.1 R11.1 R12.1 R14.1 R16.1 R19.1 R20.1 U1.1(GND) U13.9(GND) U13.18(A2) U13.22(A0) U13.23(A1) U13.25(EAD) U18.7(GND) U18.9(EP) U19.2 U20.14
BATT1_IN: H3.1 R9.2
BATT1_STPDWN: C67.1 R7.1 R9.1 R11.2
BATT2_IN: H3.2 R10.2
BATT2_STPDWN: C69.1 R6.1 R10.1 R12.2
BATT_PROT: C1.1 C2.2 C51.2 C52.2 D1.1(K) Q1.2(D) Q1.4(D) RLED1.1 U18.2(VIN) U18.3(EN)
GPIO13: H13.1 U19.3
GPIO14: H13.2 U19.5
GPIO25: H13.4 U19.8
GPIO26: H13.3 U19.7
IGN_12V: H1.1 Q1.3(S) R2.1
MAP1_SIGNAL_OUT: H4.2 R17.2
MAP1_STPDWN: C12.2 R5.1 R17.1 R19.2
MAP2_SIGNAL_OUT: H5.2 R18.2
MAP2_STPDWN: C70.2 R4.1 R18.1 R20.2
MOS_G: Q1.1(G) R1.2 R2.2
MUX_RESET: R23.1 U13.24(RESET#)
MUX_SCL: R25.2 U13.19(SCL) U20.2
MUX_SDA: R24.2 U13.20(SDA) U20.5
OLED1_SCL: H8.3 U13.2(SC0)
OLED1_SDA: H8.4 U13.1(SD0)
OLED2_SCL: H9.3 U13.4(SC1)
OLED2_SDA: H9.4 U13.3(SD1)
OLED3_SCL: H10.3 U13.6(SC2)
OLED3_SDA: H10.4 U13.5(SD2)
OLED4_SCL: H11.3 U13.8(SC3)
OLED4_SDA: H11.4 U13.7(SD3)
OLED5_SCL: H12.3 U13.11(SC4)
OLED5_SDA: H12.4 U13.10(SD4)
TC+: H6.1 R22.1
TC+AFTERPULLUP: C14.1 R22.2 U1.3(T+)
TC-: H6.2 R21.1
TC-AFTERPULLUP: C14.2 R21.2 U1.2(T-)
TC_CS: U1.6(CS#) U20.9
TC_SCK: U1.5(SCK) U20.7
TC_SO: U1.7(SO) U20.6
WB_OUT: H7.1 R3.2
WB_STPDWN: C9.2 R3.1 R8.2 R13.1
$1N464: R7.2 U19.9
$1N467: R6.2 U19.10
$1N468: R5.2 U19.11
$1N472: R13.2 U19.14
$1N473: R4.2 U19.12
$1N1205: LED5.2(A) RLED3.2
$2N754: LED1.2(A) RLED1.2
$3N360: R14.2 U18.4(RT/CLK)
$3N439: C5.1 L1.1 U18.8(SW)
$3N491: C5.2 U18.1(BST)
$3N614: C8.2 U18.6(SS)
$3N629: R15.1 R16.2 U18.5(FB)
$3N1561: LED4.2(A) RLED2.2

Not connected (* = marked no-connect by the designer): U1 8(DNC)*; U13 12(SD5)* 13(SC5)* 14(SD6)* 15(SC6)* 16(SD7)* 17(SC7)*; U19 4* 6* 13* 15*; U20 1* 3* 4* 8* 10* 11* 12* 13*

## Notes on the sheets
sheet 6
- Thermocouple
